# Altium schematic sheet Peripheral CONNECTORS.SchDoc: 分区电源管理电路板-接口
size A4; Organization: 智能实训室产品部; Address1: 广东省深圳市; Address2: 宝安区石岩凯普达工业园; DocumentNumber: 190416; Revision: V1.0; SheetNumber: 2; SheetTotal: 6; Date: 2019-4-24; ApprovedBy: 杨青; CheckedBy: 杨青; DrawnBy: 杨青; Engineer: 杨青; ProjectName_GTA: 实训室智能化管理系统; PCB Number: GS-P1B-GXO02
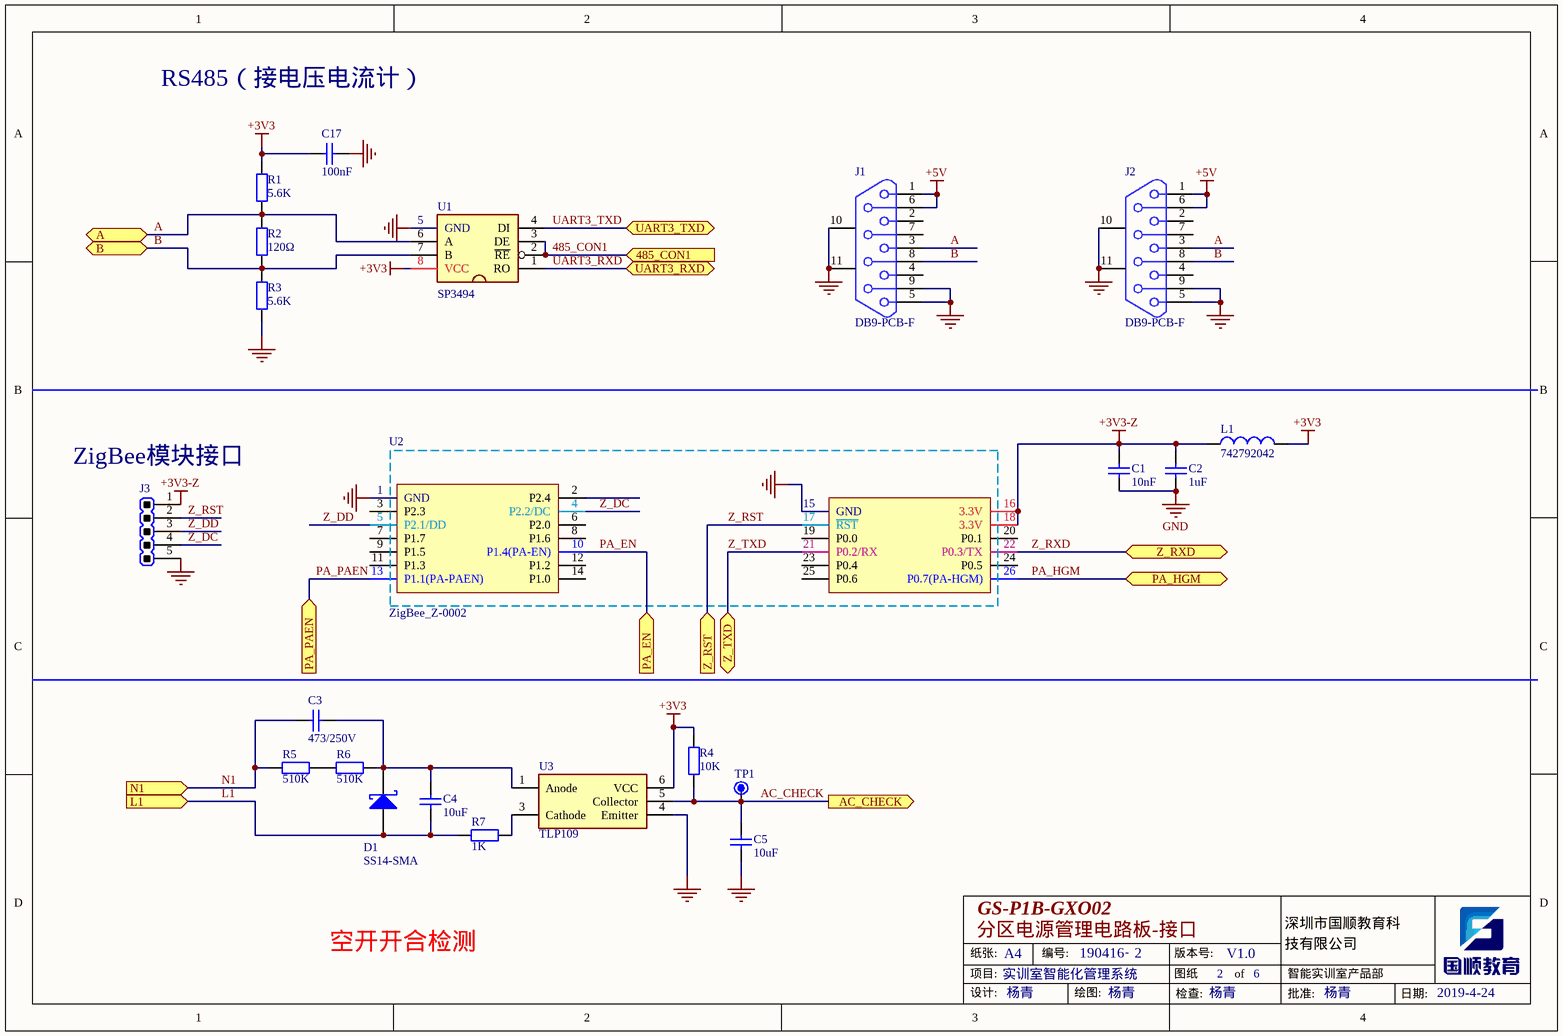
[diagram p0: Peripheral CONNECTORS.SchDoc]

## Parts
C1  10nF  [C0603]
C2  1uF  [C0603]
C3  473/250V  [CBB-10/13X6]
C4  10uF  [C0805]
C5  10uF  [C0603]
C17  100nF  [C0603]
D1  SS14-SMA  [DO-214AC/SMA/SOD106]
J1  DB9-PCB-F  [DB9-PCB-F]
J2  DB9-PCB-F  [DB9-PCB-F]
J3  HDRM-2.54/11-1*5P-AK  [HDRM-2.54-1*5P-AK1]  (value not drawn)  (no BOM)
L1  742792042  [L0805]
R1  5.6K  [R0603]
R2  120Ω  [R0603]
R3  5.6K  [R0603]
R4  10K  [R0603]
R5  510K  [R0805]
R6  510K  [R0805]
R7  1K  [R0805]
TP1  TP-2.0-1P-SMD  [TP1-2.0/F3.0-S]  (value not drawn)
U1  SP3494  [SOP8-1.27/4.4]
U2  ZigBee_Z-0002  [Module_ZigBee_Z-0002]
U3  TLP109  [SO6-5P-1.27/3.7]

## Ports
485_CON1 (in), A (bidir), AC_CHECK (out), B (bidir), L1 (in), N1 (in), PA_EN (in), PA_HGM (bidir), PA_PAEN (in), UART3_RXD (bidir), UART3_TXD (bidir), Z_RST (in), Z_RXD (bidir), Z_TXD (bidir)

## Nets
+3V3: C17.1 L1.1 R1.2 R4.1 U1.8(VCC) U3.6(VCC)
+3V3-Z: C1.2 C2.1 J3.1 L1.2 U2.16(3.3V) U2.18(3.3V)
+5V: J1.1 J1.6 J2.1 J2.6
GND: C1.1 C2.2 C5.1 C17.2 J1.5 J1.9 J1.10 J1.11 J2.5 J2.9 J2.10 J2.11 J3.5 R3.1 U1.5(GND) U2.1(GND) U2.15(GND) U3.4(Emitter)
485_CON1: U1.2(~{RE}) U1.3(DE) ; port 485_CON1
A: J1.3 J2.3 R1.1 R2.2 U1.6(A) ; port A
AC_CHECK: C5.2 R4.2 TP1.1 U3.5(Collector) ; port AC_CHECK
B: J1.8 J2.8 R2.1 R3.2 U1.7(B) ; port B
L1: C4.2 D1.1(A) R7.1 ; port L1
N1: C3.1 R5.1 ; port N1
PA_EN: U2.10(P1.4(PA-EN)) ; port PA_EN
PA_HGM: U2.26(P0.7(PA-HGM)) ; port PA_HGM
PA_PAEN: U2.13(P1.1(PA-PAEN)) ; port PA_PAEN
UART3_RXD: U1.1(RO) ; port UART3_RXD
UART3_TXD: U1.4(DI) ; port UART3_TXD
Z_DC: J3.4 U2.4(P2.2/DC)
Z_DD: J3.3 U2.5(P2.1/DD)
Z_RST: J3.2 U2.17(~{RST}) ; port Z_RST
Z_RXD: U2.22(P0.3/TX) ; port Z_RXD
Z_TXD: U2.21(P0.2/RX) ; port Z_TXD
NetC3_2: C3.2 C4.1 D1.2(K) R6.2 U3.1(Anode)
NetR5_2: R5.2 R6.1
NetR7_2: R7.2 U3.3(Cathode)

Not connected (* = marked no-connect by the designer): J1 2 4 7; J2 2 4 7; U2 2(P2.4) 3(P2.3) 6(P2.0) 7(P1.7) 8(P1.6) 9(P1.5) 11(P1.3) 12(P1.2) 14(P1.0) 19(P0.0) 20(P0.1) 23(P0.4) 24(P0.5) 25(P0.6)

## Notes on the sheet
- RS485（接电压电流计）
- (near J3) ZigBee模块接口
- 空开开合检测
- 纸张:
- 项目:
- A4
- 编号:
- -
- 版本号:
- 图纸
- of
- 深圳市国顺教育科
- 技有限公司
- 设计:
- 绘图:
- 检查:
- 批准:
- 日期:

## Library data of the parts
C1 = 10nF_16V_0603: Capacitor; 编码: 无; 规格/型号: 10nF,16V,0603; 物料名称: 贴片电容
C2 = 1uF_25V_X7R_0603: Capacitor; 编码: 无; 规格/型号: 1uF,25V,X7R,0603; 物料名称: 贴片电容
C3 = CBB-473/250V: CBB; 物料名称: CBB电容; 规格/型号: CBB,473,250V,脚距10,尺寸13X6
C4 = 10uF_25V_±10%_X7R_0805: CAP,10uF,106K,25V,±10%,X7R,0805; 物料名称: 贴片电容; 单价: 0.19; 供应商: https://detail.tmall.com/item.htm?id=41292633455&ali_refid=a3_430583_1006:1109983619:N:0805%2010uf:100c1b5182542bfe0f4941751bbe292f&ali_trackid=1_100c1b5182542bfe0f4941751bbe292f&spm=a230r.1.14.1&skuId=3812963548524; 规格/型号: 10uF,106K,25V,±10%,X7R,0805; 参数: 25V,±10%,X7R
C5 = 10uF_16V_0603: Capacitor; 编码: 无; 规格/型号: 10uF,16V,0603; 物料名称: 贴片电容
C17 = 100nF_50V_0603: Capacitor; 编码: 无; 规格/型号: 100nF,50V,0603; 物料名称: 贴片电容
D1 = SS14_DO-214AC/SMA: SS14,1A/40V,SMA; 规格/型号: SS14,1A/40V,SMA/DO-214AC; 品牌: MDD; 物料名称: 贴片二极管; 单价: 0.07; 供应商: https://item.taobao.com/item.htm?spm=a1z10.3-c-s.w4002-16569462289.12.3c256a4bZbu252&id=545421128477; 参数: 1A/40V
J1 J2 = DB9-PCB-F: DB9,直插母座; 编码: 1011707018; 规格/型号: DB9,母头,直插 立式 180度,带固定螺丝柱,PCB焊接式; 物料名称: 串口座
J3 = HDRM-2.54/11-1*5P-AK: 排针,直; 规格/型号: 排针,间距2.54,针长11mm,1*5P,180°直插; 物料名称: 排针
L1 = L_BEAD-742792042-0805: WE-CBF,600@100M,500Ohm,200mA,0805,742792042; 品牌: WE; 物料名称: 贴片磁珠; 规格/型号: WE-CBF,磁珠,600@100M,500Ohm,200mA,0805,742792042
R1 R3 = 5.6K_5%_0603: 5.6K,±5%,0603; 物料名称: 贴片电阻; 单价: 0.02; 规格/型号: 5.6K,±5%,0603; 参数: ±5%
R2 = 120Ω_5%_0603: 120Ω,±5%,0603; 物料名称: 贴片电阻; 单价: 0.02; 规格/型号: 120Ω,±5%,0603; 参数: ±5%
R4 = 10K_5%_0603: 10K,±5%,0603; 物料名称: 贴片电阻; 单价: 0.02; 规格/型号: 10K,±5%,0603; 参数: ±5%
R5 R6 = 510K_0805_5%: 物料名称: 贴片电阻; 编码: 1010101034; 规格/型号: 510K_0805_5%
R7 = 1K_5%_0805: 1K,±5%,0805; 物料名称: 贴片电阻; 编码: 1010101038; 单价: 0.02; 规格/型号: 1K,±5%,0805; 参数: ±5%
TP1 = TP-2.0-1P-SMD: 测试点; 编码: 无需安装; 物料名称: 测试点
U1 = SP3494_SOP8: 485通信芯片; 物料名称: 贴片芯片; 编码: 1010501043; 规格/型号: SP3494,SOP-8
U2 = Module_ZigBee_Z-0002: zigbee模块; 单价: 46; 品牌: 蜂汇; 物料名称: 电路模块; 规格/型号: ZigBee模块,蜂汇Z-0002,带PA,CC2530+CC2591,SMA,2.54排针; 供应商: https://item.taobao.com/item.htm?spm=2013.1.0.0.78a73417EKZBvr&id=19051924425
U3 = OPTO_TLP109-SO6: 光耦; 编码: 1010501087; 规格/型号: TLP109,SO6,TOSHIBA; 品牌: TOSHIBA; 物料名称: 贴片芯片